# EAGLE schematic quadrature-QCN-19+ (EAGLE 9.2.2)
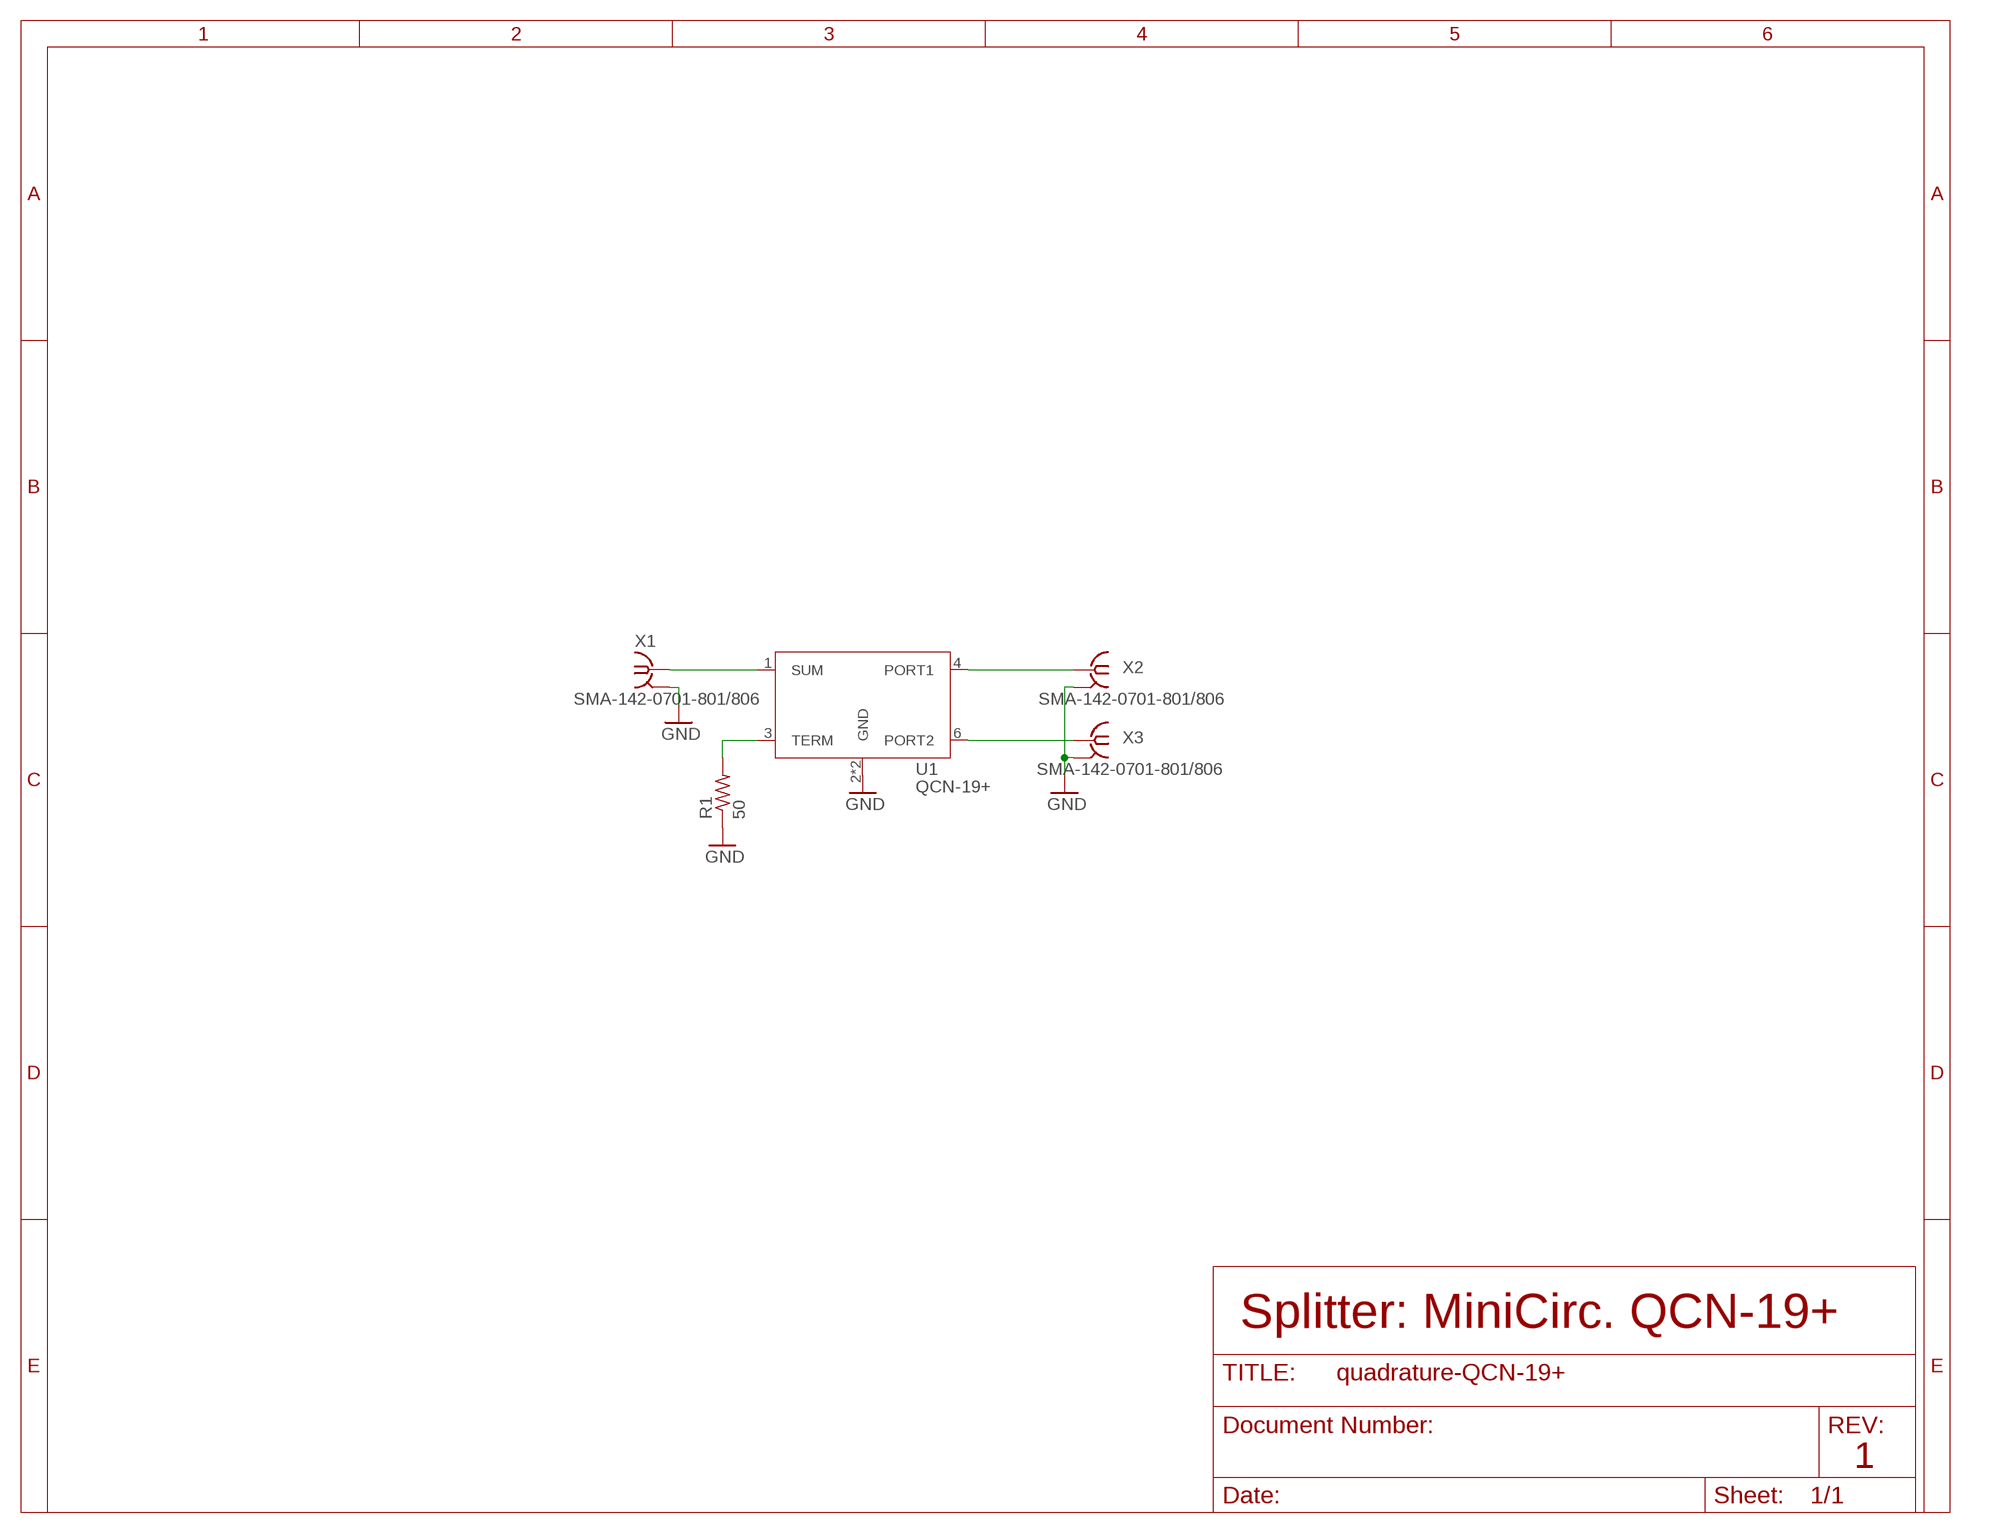
[diagram p0: schematic, sheet 1]

## Parts
R1  50  R-US_0402-B-NOSILK  [.0402-B-NOSILK]
U1  QCN-19+  [QCN-19+]
X1  SMA-142-0701-801/806  [J502-ND-142-0701-801/806]
X2  SMA-142-0701-801/806  [J502-ND-142-0701-801/806]
X3  SMA-142-0701-801/806  [J502-ND-142-0701-801/806]

## Nets
GND: R1.1 U1.2(GND) U1.5(GND) X1.G@1 X1.G@2 X1.G@3 X1.G@4 X2.G@1 X2.G@2 X2.G@3 X2.G@4 X3.G@1 X3.G@2 X3.G@3 X3.G@4
N$49: R1.2 U1.3(TERM)
N$50: U1.1(SUM) X1.1
N$51: U1.4(PORT1) X2.1
N$52: U1.6(PORT2) X3.1

## Notes on the sheet
- Splitter: MiniCirc. QCN-19+
- 1

## Library data of the parts
R1 = oresat-rcl:R-US_: RESISTOR, American symbol
U1 = U-MiniCirc-QCN-19+-quad:QCN-19+: RF Power Splitter/Combiner, Quadrature, 1.1 - 1.925 GHz
X1-X3 = con-coax:SMA-: SMA 50 Ohm End Launch Jack Receptacle - Round Contact Johnson Components Source: www.johnsoncomponents.com .. J502-ND.pdf; MF: JOHNSON COMPONENTS; MPN: 142-0701-801; OC_FARNELL: 1608592; OC_NEWARK: 90F2624